# Altium project TOF_rangefinder.PrjPcb
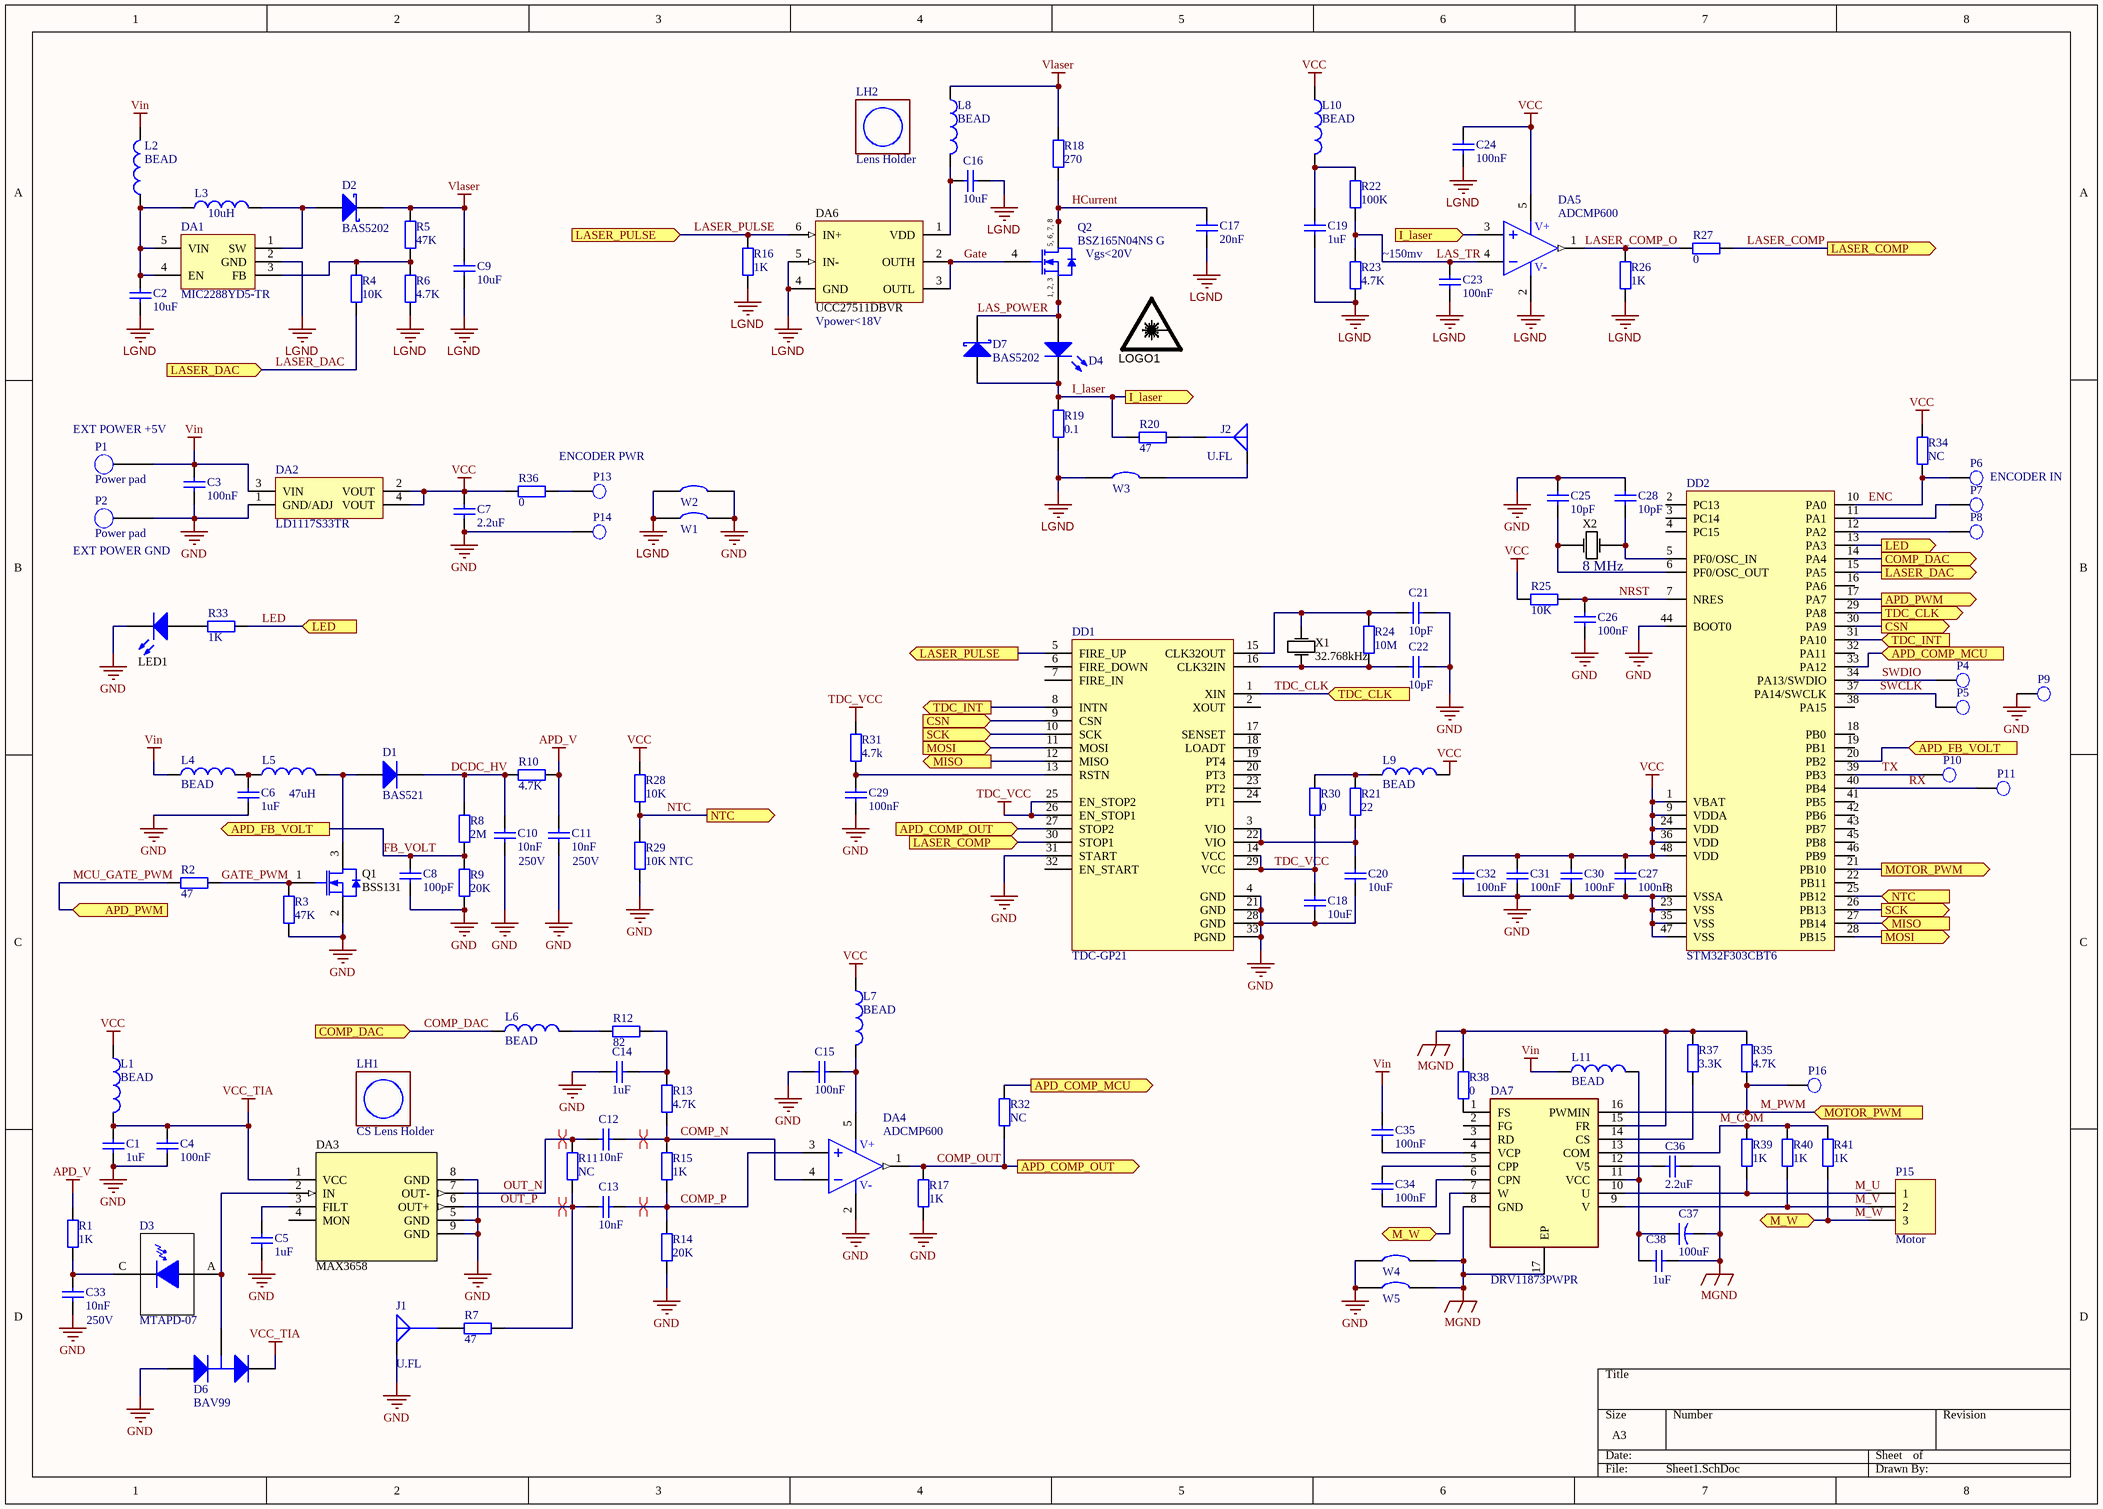
[diagram p0: Sheet1.SchDoc]
1 sheet, 134 parts. Net scope: flat (ports and power ports of the same name join across sheets).
Board file: PCB1.PcbDoc

## Sheet Sheet1.SchDoc
size A3; PageSetup: Record=PageOptions|CenterHorizontal=True|CenterVertical=True|PrintScale=0.73|XCorrection=1.00|YCorrection=1.00|PrintKind=0|BorderSize=5000000|LeftOffset=0|BottomOffset=0|Orientation=2|PaperLength=1000|PaperWidth=1000|Scale=100|PaperSource=7|PrintQuality=-3|MediaType=1|DitherType=10|PrintScaleMode=1|PaperKind=A4|PaperIndex=9

### Parts
C1  1uF  [CAPC2012X135N]
C2  10uF  [CAPC1608X90N]
C3  100nF  [CAPC1608X90N]
C4  100nF  [CAPC1608X90N]
C5  1uF  [CAPC2012X135N]
C6  1uF  [CAPC2012X135N]
C7  2.2uF  [CAPC1608X90N]
C8  100pF  [CAPC1608X90N]
C9  10uF  [CAPC1608X90N]
C10  Voltage: 250V  [CAPC2012X135N]  (hidden comment: 10nF)
C11  Voltage: 250V  [CAPC2012X135N]  (hidden comment: 10nF)
C12  10nF  [CAPC1608X90N]
C13  10nF  [CAPC1608X90N]
C14  1uF  [CAPC2012X135N]
C15  100nF  [CAPC1608X90N]
C16  10uF  [CAPC1608X90N]
C17  20nF  [CAPC1608X90N]
C18  10uF  [CAPC1608X90N]
C19  1uF  [CAPC1608X90N]
C20  10uF  [CAPC1608X90N]
C21  10pF  [CAPC1608X90N]
C22  10pF  [CAPC1608X90N]
C23  100nF  [CAPC1608X90N]
C24  100nF  [CAPC1608X90N]
C25  10pF  [CAPC1608X90N]
C26  100nF  [CAPC1608X90N]
C27  100nF  [CAPC1608X90N]
C28  10pF  [CAPC1608X90N]
C29  100nF  [CAPC1608X90N]
C30  100nF  [CAPC1608X90N]
C31  100nF  [CAPC1608X90N]
C32  100nF  [CAPC1608X90N]
C33  Voltage: 250V  [CAPC2012X135N]  (hidden comment: 10nF)
C34  100nF  [CAPC1608X90N]
C35  100nF  [CAPC1608X90N]
C36  2.2uF  [CAPC1608X90N]
C37  value 100uF  [CAPR5-4X5]  (hidden comment: Cap2)
C38  1uF  [CAPC1608X90N]
D1  BAS521  [SOD523F]
D2  BAS5202  [SOD523F]
D3  MTAPD-07  [LCC3]
D4  Laser SPL PL90_3  [SPL_PL90]  (value not drawn)
D6  BAV99  [SOT-23]
D7  BAS5202  [SOD523F]
DA1  MIC2288YD5-TR  [SOT23-5]
DA2  LD1117S33TR  [SOT223]
DA3  MAX3658  [TDFN-8_0.65]
DA4  ADCMP600  [SOT23-5]
DA5  ADCMP600  [SOT23-5]
DA6  UCC27511DBVR  [SOT23-6_M]
DA7  DRV11873PWPR  [SOP65P640X120-17N]
DD1  TDC-GP21  [QFN32 5x5mm]
DD2  STM32F303CBT6  [LQFP-48_N]
J1  U.FL  [TE C-1909763]
J2  U.FL  [TE C-1909763]
L1  BEAD  [INDC1608N]
L2  BEAD  [INDC1608N]
L3  value 10uH  [V0805HD]  (hidden comment: Inductor)
L4  BEAD  [INDC1608N]
L5  value 47uH  [INDC3216]  (hidden comment: Inductor)
L6  BEAD  [INDC1608N]
L7  BEAD  [INDC1608N]
L8  BEAD  [INDC1608N]
L9  BEAD  [INDC1608N]
L10  BEAD  [INDC1608N]
L11  BEAD  [INDC1608N]
LED1  LED  [LED_0603]  (value not drawn)
LH1  CS Lens Holder  [Lens Holder CS]
LH2  Lens Holder  [LENS_HOLDER_20MM_ADJ]
LOGO1  LASER RADIATION  [LaserWarning_Small]  (value not drawn)  (no BOM)
P1  Power pad  [Ext_power_pad]
P2  Power pad  [Ext_power_pad]
P4  Pad  [Ext_pad_2]  (value not drawn)
P5  Pad  [Ext_pad_2]  (value not drawn)
P6  Pad  [Ext_hole]  (value not drawn)
P7  Pad  [Ext_pad_2]  (value not drawn)
P8  Pad  [Ext_pad_2]  (value not drawn)
P9  Pad  [Ext_pad_2]  (value not drawn)
P10  Pad  [Ext_pad_2]  (value not drawn)
P11  Pad  [Ext_pad_2]  (value not drawn)
P13  Pad  [Ext_hole]  (value not drawn)
P14  Pad  [Ext_hole]  (value not drawn)
P15  Motor  [HDR1X3]
P16  Pad  [Ext_pad_small]  (value not drawn)
Q1  BSS131  [INF-PG-SOT23_N]
Q2  BSZ165N04NS G  [INF-PG-TSDSON-8-1_A_V]
R1  1K  [RESC1608X55N]
R2  47  [RESC1608X55N]
R3  47K  [RESC1608X55N]
R4  10K  [RESC1608X55N]
R5  47K  [RESC1608X55N]
R6  4.7K  [RESC1608X55N]
R7  47  [RESC1608X55N]
R8  2M  [RESC2012X70N]
R9  20K  [RESC1608X55N]
R10  4.7K  [RESC1608X55N]
R11  NC  [RESC1608X55N]
R12  82  [RESC1608X55N]
R13  4.7K  [RESC1608X55N]
R14  20K  [RESC2012X70N]
R15  1K  [RESC1608X55N]
R16  1K  [RESC1608X55N]
R17  1K  [RESC1608X55N]
R18  270  [RESC1608X55N]
R19  0.1  [RESC2012X70N]
R20  47  [RESC1608X55N]
R21  22  [RESC1608X55N]
R22  100K  [RESC1608X55N]
R23  4.7K  [RESC1608X55N]
R24  10M  [RESC1608X55N]
R25  10K  [RESC1608X55N]
R26  1K  [RESC1608X55N]
R27  0  [RESC1608X55N]
R28  10K  [RESC1608X55N]
R29  10K NTC  [RESC1608X55N]
R30  0  [RESC1608X55N]
R31  4.7k  [RESC1608X55N]
R32  NC  [RESC1608X55N]
R33  1K  [RESC1608X55N]
R34  NC  [RESC1608X55N]
R35  4.7K  [RESC1608X55N]
R36  0  [RESC1608X55N]
R37  3.3K  [RESC1608X55N]
R38  0  [RESC1608X55N]
R39  1K  [RESC1608X55N]
R40  1K  [RESC1608X55N]
R41  1K  [RESC1608X55N]
W1  NET connector  [Net connector]  (value not drawn)  (net tie, no BOM)
W2  NET connector  [Net connector]  (value not drawn)  (net tie, no BOM)
W3  NET connector  [Net connector2]  (value not drawn)  (net tie, no BOM)
W4  NET connector  [Net connector]  (value not drawn)  (net tie, no BOM)
W5  NET connector  [Net connector]  (value not drawn)  (net tie, no BOM)
X1  32.768kHz  [QUARTZ_32K]
X2  value 8 MHz  [SX-6 QUARTZ]  (hidden comment: Quartz)

### Ports
APD_COMP_MCU (in), APD_COMP_MCU (out), APD_COMP_OUT (in), APD_COMP_OUT (out), APD_FB_VOLT (in), APD_FB_VOLT (out), APD_PWM (in), APD_PWM (out), COMP_DAC (in), COMP_DAC (out), CSN (in), CSN (out), I_laser (in), I_laser (out), LASER_COMP (in), LASER_COMP (out), LASER_DAC (in), LASER_DAC (out), LASER_PULSE (in), LASER_PULSE (out), LED (in), LED (out), M_W, MISO (in), MISO (out), MOSI (in), MOSI (out), MOTOR_PWM (in), MOTOR_PWM (out), NTC (in), NTC (out), SCK (in), SCK (out), TDC_CLK (in), TDC_CLK (out), TDC_INT (in), TDC_INT (out)

### Nets
APD_V: C11.2 R1.2 R10.1
GND: C1.1 C3.1 C4.1 C5.1 C6.2 C7.1 C8.2 C10.1 C11.1 C14.2 C15.2 C18.1 C20.1 C21.1 C22.1 C25.2 C26.1 C27.1 C28.2 C29.1 C30.1 C31.1 C32.1 C33.1 D6.1(A) DA2.1(GND/ADJ) DA3.5(GND) DA3.8(GND) DA3.9(GND) DA4.2(V-) DD1.4(GND) DD1.21(GND) DD1.28(GND) DD1.31(START) DD1.33(PGND) DD2.8(VSSA) DD2.23(VSS) DD2.35(VSS) DD2.44(BOOT0) DD2.47(VSS) J1.G LED1.2(K) P2.1 P9.1(Pad) P14.1(Pad) Q1.2(SOURCE) R3.2 R9.2 R14.1 R17.1 R29.1 W1.2 W2.2 W4.1 W5.1
LGND: C2.1 C9.1 C16.1 C17.1 C19.1 C23.1 C24.1 DA1.2(GND) DA5.2(V-) DA6.4(GND) DA6.5(IN-) R6.1 R16.1 R19.1 R23.2 R26.1 W1.1 W2.1 W3.1
MGND: C36.1 C37.2 C38.2 DA7.8(GND) DA7.15(FR) DA7.17(EP) R35.2 R37.2 R38.2 W4.2 W5.2
TDC_VCC: C18.2 DD1.14(VCC) DD1.25(EN_STOP2) DD1.26(EN_STOP1) DD1.29(VCC) R30.2 R31.1
VCC: C7.2 C24.2 C27.2 C30.2 C31.2 C32.2 DA2.2(VOUT) DA2.4(VOUT) DA5.5(V+) DD2.1(VBAT) DD2.9(VDDA) DD2.24(VDD) DD2.36(VDD) DD2.48(VDD) L1.1 L7.1 L9.2 L10.1 R25.1 R28.1 R34.1 R36.1
VCC_TIA: C1.2 C4.2 D6.2(K) DA3.1(VCC) L1.2
Vin: C3.2 C35.1 DA2.3(VIN) L2.2 L4.1 L11.1 P1.1
Vlaser: C9.2 D2.K L8.1 R5.2 R18.2
COMP_DAC: DD2.14(PA4) L6.1 ; port COMP_DAC
COMP_N: C12.1 DA4.4(IN-) R13.1 R15.2
COMP_OUT: DA4.1(OUT) DD1.27(STOP2) R17.2 R32.2 ; port APD_COMP_OUT
COMP_P: C13.1 DA4.3(IN+) R14.2 R15.1
DCDC_HV: C10.2 D1.K R8.2 R10.2
ENC: DD2.10(PA0) P6.1(Pad) R34.2
FB_VOLT: C8.1 DD2.20(PB2) R8.1 R9.1 ; port APD_FB_VOLT
Gate: DA6.2(OUTH) DA6.3(OUTL) Q2.4(GATE)
GATE_PWM: Q1.1(GATE) R2.2 R3.1
HCurrent: C17.2 Q2.5(DRAIN) Q2.6(DRAIN) Q2.7(DRAIN) Q2.8(DRAIN) R18.1
I_laser: D4.K D7.A DA5.3(IN+) R19.2 R20.2 ; port I_laser
LAS_POWER: D4.A D7.K Q2.1(SOURCE) Q2.2(SOURCE) Q2.3(SOURCE)
LAS_TR: C23.2 DA5.4(IN-) R22.2 R23.1
LASER_COMP: DD1.30(STOP1) R27.2 ; port LASER_COMP
LASER_COMP_O: DA5.1(OUT) R26.2 R27.1
LASER_DAC: DD2.15(PA5) R4.1 ; port LASER_DAC
LASER_PULSE: DA6.6(IN+) DD1.5(FIRE_UP) R16.2 ; port LASER_PULSE
LED: DD2.13(PA3) R33.2 ; port LED
M_COM: DA7.13(COM) R39.2 R40.2 R41.2
M_PWM: DA7.16(PWMIN) DD2.21(PB10) P16.1(Pad) R35.1 ; port MOTOR_PWM
M_U: DA7.10(U) P15.1 R39.1
M_V: DA7.9(V) P15.2 R40.1
M_W: DA7.7(W) P15.3 R41.1 ; port M_W
MCU_GATE_PWM: DD2.17(PA7) R2.1 ; port APD_PWM
NRST: C26.2 DD2.7(NRES) R25.2
NTC: DD2.25(PB12) R28.2 R29.2 ; port NTC
OUT_N: C12.2 DA3.7(OUT-) R11.2
OUT_P: C13.2 DA3.6(OUT+) R7.2 R11.1
RX: DD2.40(PB4) P11.1(Pad)
SWCLK: DD2.37(PA14/SWCLK) P5.1(Pad)
SWDIO: DD2.34(PA13/SWDIO) P4.1(Pad)
TDC_CLK: DD1.1(XIN) DD2.29(PA8) ; port TDC_CLK
TX: DD2.39(PB3) P10.1(Pad)
NetC2_2: C2.2 DA1.4(EN) DA1.5(VIN) L2.1 L3.1
NetC5_2: C5.2 DA3.3(FILT)
NetC6_1: C6.1 L4.2 L5.1
NetC14_1: C14.1 R12.1 R13.2
NetC15_1: C15.1 DA4.5(V+) L7.2
NetC16_2: C16.2 DA6.1(VDD) L8.2
NetC19_2: C19.2 L10.2 R22.1
NetC20_2: C20.2 DD1.3(VIO) DD1.22(VIO) R21.2
NetC21_2: C21.2 DD1.15(CLK32OUT) R24.2 X1.1
NetC22_2: C22.2 DD1.16(CLK32IN) R24.1 X1.2
NetC25_1: C25.1 DD2.6(PF0/OSC_OUT) X2.1
NetC28_1: C28.1 DD2.5(PF0/OSC_IN) X2.3
NetC29_2: C29.2 DD1.13(RSTN) R31.2
NetC33_2: C33.2 D3.C R1.1
NetC34_1: C34.1 DA7.5(CPP)
NetC34_2: C34.2 DA7.6(CPN)
NetC35_2: C35.2 DA7.4(VCP)
NetC36_2: C36.2 DA7.12(V5)
NetC37_1: C37.1 C38.1 DA7.11(VCC) L11.2
NetD1_A: D1.A L5.2 Q1.3(DRAIN)
NetD2_A: D2.A DA1.1(SW) L3.2
NetD3_A: D3.A D6.3(C) DA3.2(IN)
NetDA1_3: DA1.3(FB) R4.2 R5.1 R6.2
NetDA7_1: DA7.1(FS) R38.1
NetDA7_14: DA7.14(CS) R37.1
NetDD1_8: DD1.8(INTN) DD2.31(PA10) ; port TDC_INT
NetDD1_9: DD1.9(CSN) DD2.30(PA9) ; port CSN
NetDD1_10: DD1.10(SCK) DD2.26(PB13) ; port SCK
NetDD1_11: DD1.11(MOSI) DD2.28(PB15) ; port MOSI
NetDD1_12: DD1.12(MISO) DD2.27(PB14) ; port MISO
NetDD2_11: DD2.11(PA1) P7.1(Pad)
NetDD2_12: DD2.12(PA2) P8.1(Pad)
NetDD2_33: DD2.33(PA12) R32.1 ; port APD_COMP_MCU
NetJ1_S: J1.S R7.1
NetJ2_G: J2.G W3.2
NetJ2_S: J2.S R20.1
NetL6_2: L6.2 R12.2
NetL9_1: L9.1 R21.1 R30.1
NetLED1_1: LED1.1(A) R33.1
NetP13_1: P13.1(Pad) R36.2

Not connected (* = marked no-connect by the designer): DA3 4(MON); DA7 2(FG) 3(RD); DD1 2(XOUT) 6(FIRE_DOWN) 7(FIRE_IN) 17(SENSET) 18(LOADT) 19(PT4) 20(PT3) 23(PT2) 24(PT1) 32(EN_START); DD2 2(PC13) 3(PC14) 4(PC15) 16(PA6) 18(PB0) 19(PB1) 22(PB11) 32(PA11) 38(PA15) 41(PB5) 42(PB6) 43(PB7) 45(PB8) 46(PB9)

### Layout directives
differential pair: COMP_N, COMP_P, OUT_N, OUT_P

### Notes on the sheet
- (near Q2) Vgs<20V
- ~150mv
- (near DA6) Vpower<18V
- (near P1) EXT POWER +5V
- ENCODER PWR
- ENCODER IN
- (near P2) EXT POWER GND
- (in symbol BSZ165N04NS G) 5, 6, 7, 8; 1, 2, 3

### Library data of the parts
C1-C8 C12-C16 C18-C32 C34-C36 C38 = CC0805: Chip capacitor; Voltage: 25V; Series: X7R
  C1 C5 C6 C14 C19 C38: Value: 1uF
  C2 C16 C18 C20: Value: 10uF
  C3 C4 C15 C23 C24 C26 C27 C29-C32 C34 C35: Value: 100nF
  C7 C36: Value: 2.2uF
  C8: Value: 100pF
  C12 C13: Value: 10nF
  C21 C22 C25 C28: Value: 10pF
C9 C17 = CC0805: Chip capacitor; Voltage: 50V; Series: X7R
  C9: Value: 10uF
  C17: Value: 20nF
C10 C11 C33 = CC0805: Chip capacitor; Series: X7R; Value: 10nF
C37 = Cap2: Capacitor; Published: 23-Sep-2002; PackageReference: CAPR5-4X5; Publisher: Altium Limited; PackageDescription: Capacitor; 2 Leads
D1 = DIODE 2 pin: Created data: 2011-07-16; Value: BAS521
D2 D7 = D Schottky: Schottky Diode; Published: 8-Jun-2000; LatestRevisionDate: 17-Jul-2002; LatestRevisionNote: Re-released for DXP Platform.; PackageReference: SMB; Publisher: Altium Limited; PackageDescription: DO-214-AA/SMB; 2 C-Bend Leads; Body 5.3 x 3.6 mm, inc. leads (LxW); Code_JEDEC: DO-214-AA
D3 = MTAPD-07: APD photodiode; Value: MTAPD-07-013
D4 = TO-18 Laser: Value: SPL PL90_3
D6 = BAV99: Silicon Switching Diode Array for High-Speed Switching; Published: 21-Mar-2003; DatasheetDocument: Oct-1999; PackageDocument: Sep-2001; PackageReference: SOT-23; Publisher: Altium Limited; ComponentLink1Description: Manufacturer Link; ComponentLink1URL: http://www.infineon.com/; ComponentLink2Description: Datasheet; ComponentLink2URL: http://www.infineon.com/upload/Document/cmc_upload/documents/080/631/bav99series_1.pdf
DA1 = MIC2288: Step Up; Max Volt: 10V; FB_voltage: 1.24V
DA2 = LD1117S: LOW DROP FIXED AND ADJUSTABLE  POSITIVE VOLTAGE REGULATORS; Created data: 2011-08-03; Value: LD1117S33TR
DA3 = MAX3658: Transimpedance Amplifier; Part Number: AD7278
DA4 DA5 = ADCMP600: Fast comparator
DA6 = UCC27511DBVR: Single-Channel High-Speed Low-Side Gate Driver (with 4-A Peak Source and 8-A Peak Sink), DBV0006A; Alternate PartNumber: UCC27511DBVT; Manufacturer: Texas Instruments; SymbolCreator: a0411947; CompType: IC; U/M: EA; SymbolVersion: 2013-08-02; PartNumber: UCC27511DBVR; PackageReference: DBV0006A; MountType: SMT; ComponentLink1Description: Datasheet Link; ComponentLink1URL: http://www.ti.com/lit/ds/symlink/ucc27511.pdf; RoHS: Y; Publisher: Texas Instruments; LatestRevisionDate: 2015-09-01; Alternate Manufacturer: Texas Instruments
DA7 = DRV11873PWPR: Integrated Circuit; Manufacturer_Name: Texas Instruments; Datasheet Link: https://componentsearchengine.com/Datasheets/1/DRV11873PWPR.pdf; Height: 1.2mm; Manufacturer_Part_Number: DRV11873PWPR; Mouser Part Number: 595-DRV11873PWPR; Mouser Price/Stock: https://www.mouser.com/Search/Refine.aspx?Keyword=595-DRV11873PWPR; RS Part Number: 8136444P; RS Price/Stock: http://uk.rs-online.com/web/p/products/8136444P
DD1 = TDC_GP21: TDC
DD2 = STM32F3_LQFP48: Microcontroller
J1 J2 = RF Connector - SMA: U.FL Connector
L1 = BEAD: Ferrit Bead; Value: BLM18AG102SN1D; Created data: 2010-10-16
L2 L4 L6-L11 = BEAD: Ferrit Bead; Created data: 2010-10-16; Value: BEAD
L3 L5 = Inductor: Code_IEC: 1005; Published: 8-Jun-2000; LatestRevisionDate: 29-May-2009; LatestRevisionNote: IPC-7351 Footprint Added.; PackageReference: 0402-A; Publisher: Altium Limited; PackageDescription: Chip Inductor; Code_JEITA: 0402
LED1 = LED_0603
LH2 = M12 Lens Holder
LOGO1 = Laser_Warning: Laser Warning Symbol; SymbolCreator: a0412235; SymbolVersion: 8/13/2013; Published: 2009-03-03; Publisher: Texas Instruments; LatestRevisionDate: 2016-03-21
P1 P2 = Power_pad: Pad for wire
P4-P11 P13 P14 P16 = Ext Pad: Pad for wire
P15 = Header 3: Header, 3-Pin; LatestRevisionDate: 17-Jul-2002; LatestRevisionNote: Re-released for DXP Platform.; Publisher: Altium Limited
Q1 = BSS131: N-Channel SIPMOS Small-Signal-Transistor, 240 V VDS, 0.11 A ID, -55 to 150 degC, PG-SOT23, Reel, Green; Manufacturer: Infineon; Green: TRUE; ID (max): 0.11 A; IDpuls (max): 0.4 A; Ptot (max): 0.36 W; QG: 2.1 nC; RDS (on) (max): 14,000 mOhm; RDS (on) (max) (@4.5V): 20,000 mOhm; RthJA (max): 350 K/W; VDS (max): 240 V; VGS(th) (max): 1.8 V; VGS(th) (min): 0.8 V; DatasheetVersion: Rev. 2.6; PackageVersion: Apr-08; PackageReference: PG-SOT23; PackageDescription: 3-Pin Small Outline Transistor Package, 2.9 x 1.3 mm Body, 0.95 mm Pitch; Supplier 1: Farnell; Supplier Part Number 1: 1056524RL; Supplier 2: Farnell; Supplier Part Number 2: 1056524; Supplier 3: Newark; Supplier Part Number 3: 96K7109; Halogen-free: TRUE; Packing: Reel; Mounting Technology: Surface Mount; PartNumber: BSS131; ComponentLink1Description: Manufacturer URL; ComponentLink1URL: http://www.infineon.com/; ComponentLink2Description: Datasheet; ComponentLink2URL: http://www.infineon.com/dgdl/BSS131_V2.6+G.pdf?folderId=db3a3043156fd573011622e10b5c1f67&fileId=db3a304330f68606013104bf65993eeb; ComponentLink3Description: Package Specification; ComponentLink3URL: http://www.infineon.com/dgdl/SOT23-Package_Overview.pdf?folderId=db3a30431936bc4b0119532290053c66&fileId=db3a30431936bc4b0119533468123c85
Q2 = BSZ165N04NS G: N-Channel OptiMOS 3 Power-Transistor, 40 V VDS, 31 A ID, -55 to 150 degC, PG-TSDSON-8-1, Reel, Green; Manufacturer: Infineon; Green: TRUE; ID (max): 31 A; IDpuls (max): 124 A; Polarity: N; Ptot (max): 25 W; QG: 7.8 nC; RDS (on) (max): 16.5 mOhm; Rth: 5 K/W; RthJA (max): 60 K/W; VDS (max): 40 V; VGS(th) (max): 4 V; VGS(th) (min): 2 V; DatasheetVersion: Rev. 2.0; PackageVersion: Rev. 01, 03/2007; PackageReference: PG-TSDSON-8-1; PackageDescription: 8-Pin Plastic (Green) Thin Dual Small Outline Non-Leaded Package, 3.3 x 3.3 mm Body, 0.65 mm Pitch; Supplier 1: Digi-Key; Supplier Part Number 1: BSZ165N04NSGINTR-ND; Supplier 2: Digi-Key; Supplier Part Number 2: BSZ165N04NSGINCT-ND; Supplier 3: Digi-Key; Supplier Part Number 3: BSZ165N04NSGINDKR-ND; Supplier 4: Farnell; Supplier Part Number 4: 1775508; Supplier 5: Newark; Supplier Part Number 5: 60R2545; Supplier 6: Mouser; Supplier Part Number 6: 726-BSZ165N04NSG; Halogen-free: TRUE; Packing: Reel; RthJC (max): 5 K/W; Mounting Technology: Surface Mount; PartNumber: BSZ165N04NS G; ComponentLink1Description: Manufacturer URL; ComponentLink1URL: http://www.infineon.com/; ComponentLink2Description: Datasheet; ComponentLink2URL: http://www.infineon.com/dgdl/BSZ165N04NSG_rev2.pdf?folderId=db3a3043156fd5730115c7d50620107c&fileId=db3a30431689f4420116c48a64960872; ComponentLink3Description: Package Specification; ComponentLink3URL: http://www.infineon.com/dgdl/BSZ100N06LS3_rev2.3.pdf?folderId=db3a30431ddc9372011ebafa04517f8b&fileId=db3a30431ddc9372011ebb132c97000a
R1-R41 = RC0805: Chip resistor; Tolerance: 5%
  R1 R15-R17 R26 R33 R39-R41: Value: 1K
  R2 R7 R20: Value: 47
  R3 R5: Value: 47K
  R4 R25 R28: Value: 10K
  R6 R10 R13 R23 R35: Value: 4.7K
  R8: Value: 2M
  R9 R14: Value: 20K
  R11 R32 R34: Value: NC
  R12: Value: 82
  R18: Value: 270
  R19: Value: 0.1
  R21: Value: 22
  R22: Value: 100K
  R24: Value: 10M
  R27 R30 R36 R38: Value: 0
  R29: Value: 10K NTC
  R31: Value: 4.7k
  R37: Value: 3.3K
X1 = Quartz_32k: Quartz
X2 = Quartz_SX-6: Quartz_SX-6 (SMD06035C4)